# Altium project WireLessPhone.PrjPcb
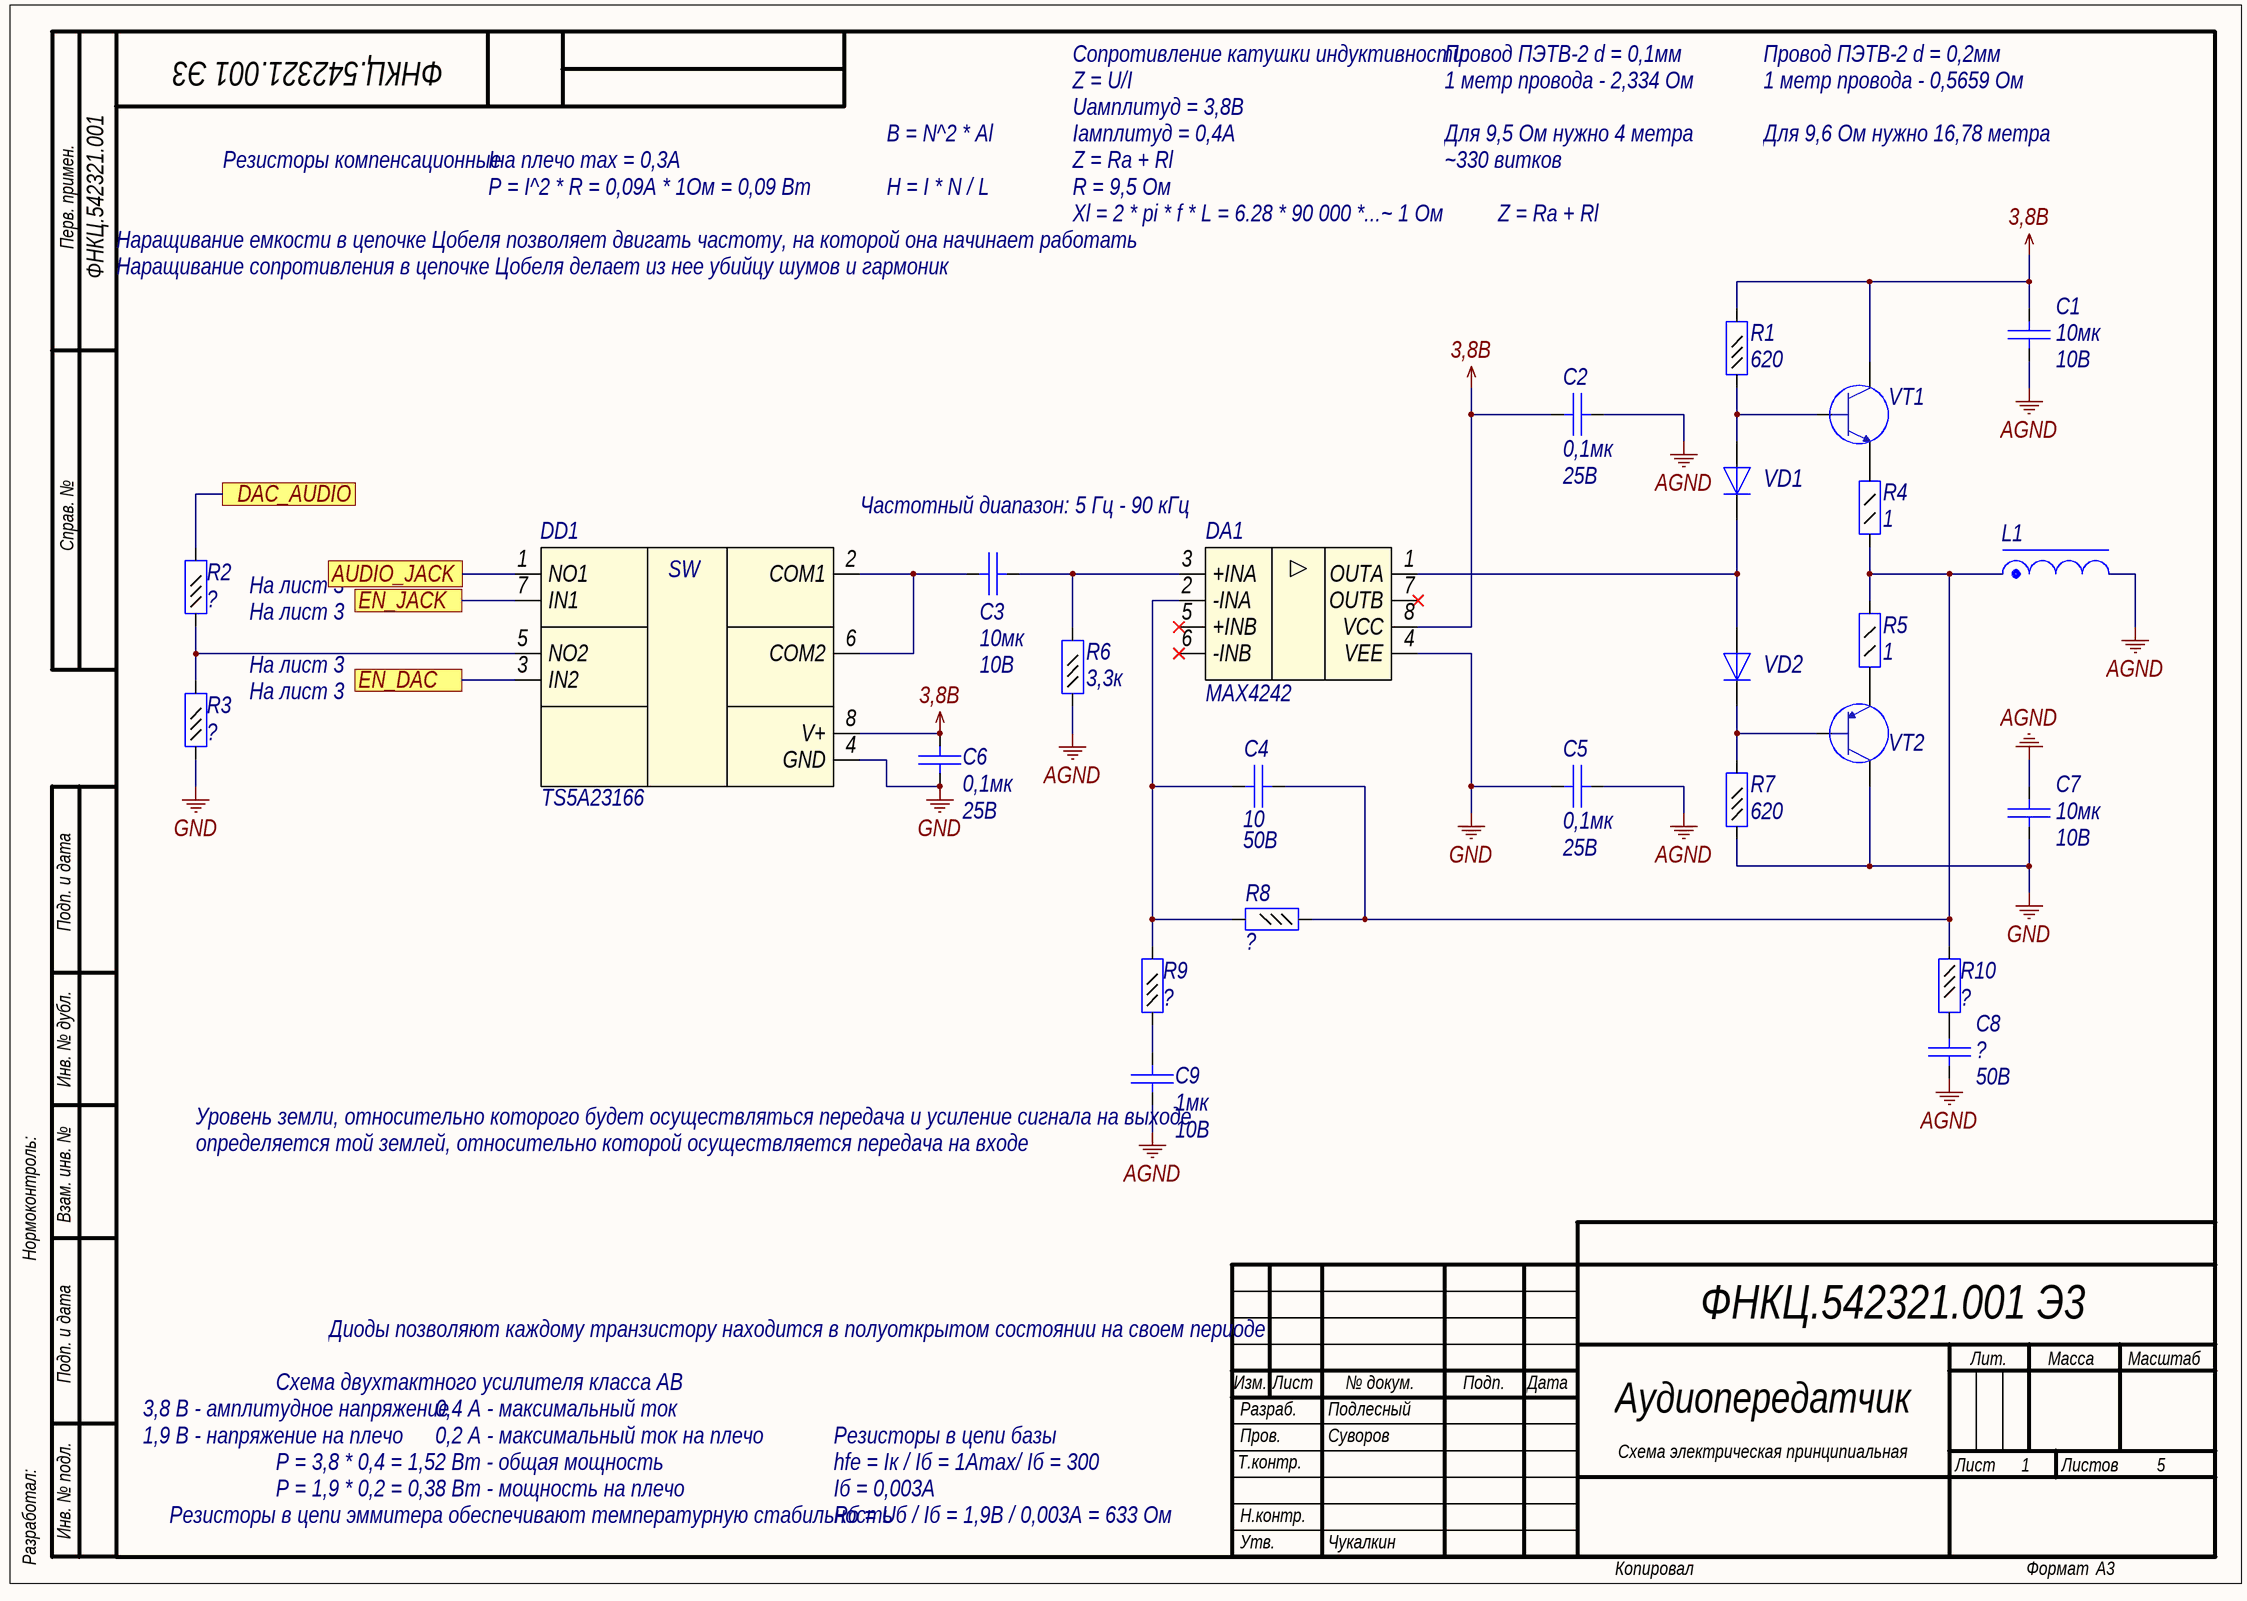
[diagram p0: WireLessPhone_Amp.SchDoc]
4 sheets, 91 parts. Net scope: flat (ports and power ports of the same name join across sheets).
Board file: WireLessPhone.PcbDoc
Sheets:
  WireLessPhone_Amp.SchDoc
  WireLessPhone_Power.SchDoc
  WireLessPhone_Microcontroller.SchDoc
  WireLessPhone_PhotoHall.SchDoc

## Sheet WireLessPhone_Amp.SchDoc: Аудиопередатчик
size 420 x 297 mm; ApprovedBy: Чукалкин; CheckedBy: Суворов; DrawnBy: Подлесный; DocumentNumber: ФНКЦ.542321.001 Э3; SheetNumber: 1; SheetTotal: 5; DocumentType: Схема электрическая принципиальная; Format: A3; ImagePath: ФНКЦ.542321.001

### Parts
C1  value 10мк  Voltage: 10В  [C0805]  (hidden comment: Capacitor)
C2  value 0,1мк  Voltage: 25B  [C0402]  (hidden comment: Capacitor)
C3  value 10мк  Voltage: 10В  [C0805]  (hidden comment: Capacitor)
C4  value 10  Voltage: 50B  [C0402]  (hidden comment: Capacitor)
C5  value 0,1мк  Voltage: 25B  [C0402]  (hidden comment: Capacitor)
C6  value 0,1мк  Voltage: 25B  [C0402]  (hidden comment: Capacitor)
C7  value 10мк  Voltage: 10В  [C0805]  (hidden comment: Capacitor)
C8  Voltage: 50B  [C0402]  (hidden comment: Capacitor)
C9  value 1мк  Voltage: 10B  [C0402]  (hidden comment: Capacitor)
DA1  MAX4242  [8µMAX]
DD1  TS5A23166  [US8]
L1  InductorSerd  [InductorPetlya]  (value not drawn)
R1  value 620  [R0402]  (hidden comment: Resistor_0,062Вт)
R2  Resistor_0,062Вт  [R0402]  (value not drawn)
R3  Resistor_0,062Вт  [R0402]  (value not drawn)
R4  value 1  [R0805]  (hidden comment: Resistor_0,125Вт)
R5  value 1  [R0805]  (hidden comment: Resistor_0,125Вт)
R6  value 3,3к  [R0402]  (hidden comment: Resistor_0,062Вт)
R7  value 620  [R0402]  (hidden comment: Resistor_0,062Вт)
R8  Resistor_0,062Вт  [R0402]  (value not drawn)
R9  Resistor_0,062Вт  [R0402]  (value not drawn)
R10  Resistor_0,062Вт  [R0402]  (value not drawn)
VD1  Diode  [SOD-323]  (value not drawn)
VD2  Diode  [SOD-323]  (value not drawn)
VT1  BJT NPN  [SOT-223]  (value not drawn)
VT2  BJT PNP  [SOT-223]  (value not drawn)

### Ports
AUDIO_JACK, DAC_AUDIO, EN_DAC, EN_JACK

### Nets
3,8B: C1.2 C2.2 C6.1 DA1.8(VCC) DD1.8(V+) R1.2 VT1.2
AGND: C1.1 C2.1 C5.1 C7.2 C8.1 C9.1 L1.2 R6.1
GND: C5.2 C6.2 C7.1 DA1.4(VEE) DD1.4(GND) R3.1 R7.1 VT2.2
NetC3_1: C3.1 DD1.2(COM1) DD1.6(COM2)
NetC3_2: C3.2 DA1.3(+INA) R6.2
NetC4_1: C4.1 DA1.2(-INA) R8.2 R9.2
NetC4_2: C4.2 L1.1 R4.1 R5.2 R8.1 R10.1
NetC8_2: C8.2 R10.2
NetC9_2: C9.2 R9.1
NetDA1_1: DA1.1(OUTA) VD1.1(K) VD2.2(A)
NetDD1_1: DD1.1(NO1) ; port AUDIO_JACK
NetDD1_3: DD1.3(IN2) ; port EN_DAC
NetDD1_5: DD1.5(NO2) R2.1 R3.2
NetDD1_7: DD1.7(IN1) ; port EN_JACK
NetDD3_8: R2.2 ; port DAC_AUDIO
NetR1_1: R1.1 VD1.2(A) VT1.1
NetR4_2: R4.2 VT1.3
NetR5_1: R5.1 VT2.3
NetR7_2: R7.2 VD2.1(K) VT2.1

Not connected (* = marked no-connect by the designer): DA1 5(+INB)* 6(-INB)* 7(OUTB)*

### Notes on the sheet
- Сопротивление катушки индуктивности:
- Z = U/I
- Uамплитуд = 3,8B
- Провод ПЭТВ-2 d = 0,1мм
- 1 метр провода - 2,334 Ом
- Провод ПЭТВ-2 d = 0,2мм
- 1 метр провода - 0,5659 Ом
- Перв. примен.
- Резисторы компенсационные
- Iна плечо max = 0,3A
- B = N^2 * Al
- Iамплитуд = 0,4A
- Z = Ra + Rl
- Для 9,5 Ом нужно 4 метра
- ~330 витков
- Для 9,6 Ом нужно 16,78 метра
- Наращивание емкости в цепочке Цобеля позволяет двигать частоту, на которой она начинает работать
- P = I^2 * R = 0,09A * 1Ом = 0,09 Вт
- H = I * N / L
- R = 9,5 Ом
- Xl = 2 * pi * f * L = 6.28 * 90 000 *...~ 1 Ом
- Наращивание сопротивления в цепочке Цобеля делает из нее убийцу шумов и гармоник
- Справ. №
- Частотный диапазон: 5 Гц - 90 кГц
- (near R2) На лист 3
- (near R3) На лист 3
- На лист 3
- Подп. и дата
- Инв. № дубл.
- (near C9) Уровень земли, относительно которого будет осуществляться передача и усиление сигнала на выходе
- Нормоконтроль:
- Взам. инв. №
- (near C9) определяется той землей, относительно которой осуществляется передача на входе
- Диоды позволяют каждому транзистору находится в полуоткрытом состоянии на своем периоде
- Схема двухтактного усилителя класса АВ
- Изм.
- Лист
- № докум.
- Подп.
- Дата
- Лит.
- Масса
- Масштаб
- 3,8 В - амплитудное напряжение
- 1,9 В - напряжение на плечо
- Р = 3,8 * 0,4 = 1,52 Вт - общая мощность
- 0,4 А - максимальный ток
- 0,2 А - максимальный ток на плечо
- Резисторы в цепи базы
- hfe = Iк / Iб = 1Amax/ Iб = 300
- Т.контр.
- Пров.
- Разраб.
- Листов
- Разработал:
- Инв. № подл.
- Резисторы в цепи эммитера обеспечивают температурную стабильность
- Р = 1,9 * 0,2 = 0,38 Вт - мощность на плечо
- Iб = 0,003A
- Rб = Uб / Iб = 1,9В / 0,003A = 633 Ом
- Н.контр.
- Утв.
- Копировал
- Формат
- (in symbol logic11) SW

### Library data of the parts
C1 C3 C7 = cap201: Конденсатор; Part Name: Ceramic; Manufacture: Murata; Part Number: GRM21BR71A106KE51L; id: cap201; TKE: X7R
C2 C5 C6 = cap52: Конденсатор; Part Name: Ceramic; Manufacture: Murata; Part Number: GRM155F51E104Z**; id: cap52; TKE: Y5V
C4 C8 = cap5: Конденсатор; Part Name: Ceramic; Manufacture: Murata; Part Number: GRM1535C1H100J; id: cap5; TKE: NP0
  C8: Value: ?
C9 = cap55: Конденсатор; Part Name: Ceramic; Manufacture: Murata; Part Number: GRM155R61A105K; id: cap55; TKE: Y5V
DA1 = amp13: МИКРОМОЩНЫЙ Single/Dual/Quad, +1.8V/10µA, SOT23,  Beyond-the-Rails Op Amps; Part Name: Micropower / Operational Amplifiers; Part Number: MAX4242EUA; Manufacture: Maxim Integrated; id: amp13; Rail-to-rail: yes; Supply Voltage: 1,8В–5,5В or (+-)0,9В-(+-)2,75B; Supply Current max: 10uA; Bandwidth: 90kHz; Input Bias Current: (+-)2,3nA; CMRR: 90dB; PSRR: 85dB; Offset voltage: (+-)0,2mB; Channels: 1
DD1 = logic11: Dual-SPST Analog Switch; Manufacture: Texas Instruments; Type of Logic: CMOS; Number of elements: 2; Logic High Level: 1,5-5,5B; Logic Low Level: 0,6B; Charge Injection: 6pC; Toff: 5ns; Ton: 8,5ns; Resistance of channel: 1,1Ohm; Power Supply: 1,65В-5,5B; id: logic11; Part Name: Dual-SPST Analog Switch; Part Number: TS5A23166
L1 = ind67: EMI Suppression Filter; Part Name: My own inductor for petlya; id: ind67
R1 R7 = res261: Резистор; Manufacture: Yageo; Part Number: RC0402FR-07620RL; id: res261; Accuracy: 1%; Part Name: Resistor; Power: 0,062Вт
R2 R3 R6 R8-R10 = res278: Резистор; Manufacture: Yageo; Part Number: RC0402FR-072K3; id: res278; Accuracy: 1%; Part Name: Resistor; Power: 0,062Вт
  R2 R3 R8-R10: Value: ?
R4 R5 = res1: Резистор; Manufacture: Yageo; Part Number: RC0805FR-071RL; id: res1; Accuracy: 1%; Part Name: Resistor; Power: 0,125Вт
VD1 VD2 = diode18: Диод; Part Number: BAS321.115; Manufacture: NXP Semiconductor; Max Reverse Voltage: 250В; Forward Voltage: 1,25В; Forward Current: 0,25А; Breakdown Current: 100nA; Reverse Recovery time: 50ns; Capacitance: 2pF; Number of Channels: 1; id: diode18; Part Name: Diode
VT1 = bjt3: Part Name: Transistor; Part Number: PBSS4540Z.115; Manufacture: NXP Semiconductor; id: bjt3; hfe: 300; Vceo max: 40В; Ic max: 5А; Power: 2Вт; Frequency: 130МГц; Structure: npn
VT2 = bjt4: Part Name: Transistor; Part Number: PBSS5540Z.115; Manufacture: NXP Semiconductor; id: bjt4; hfe: 300; Vceo max: 40В; Ic max: 5А; Power: 2Вт; Frequency: 130МГц; Structure: pnp

## Sheet WireLessPhone_Power.SchDoc
size 420 x 297 mm; DocumentNumber: ФНКЦ.542321.001 Э3; SheetNumber: 2; Format: A3
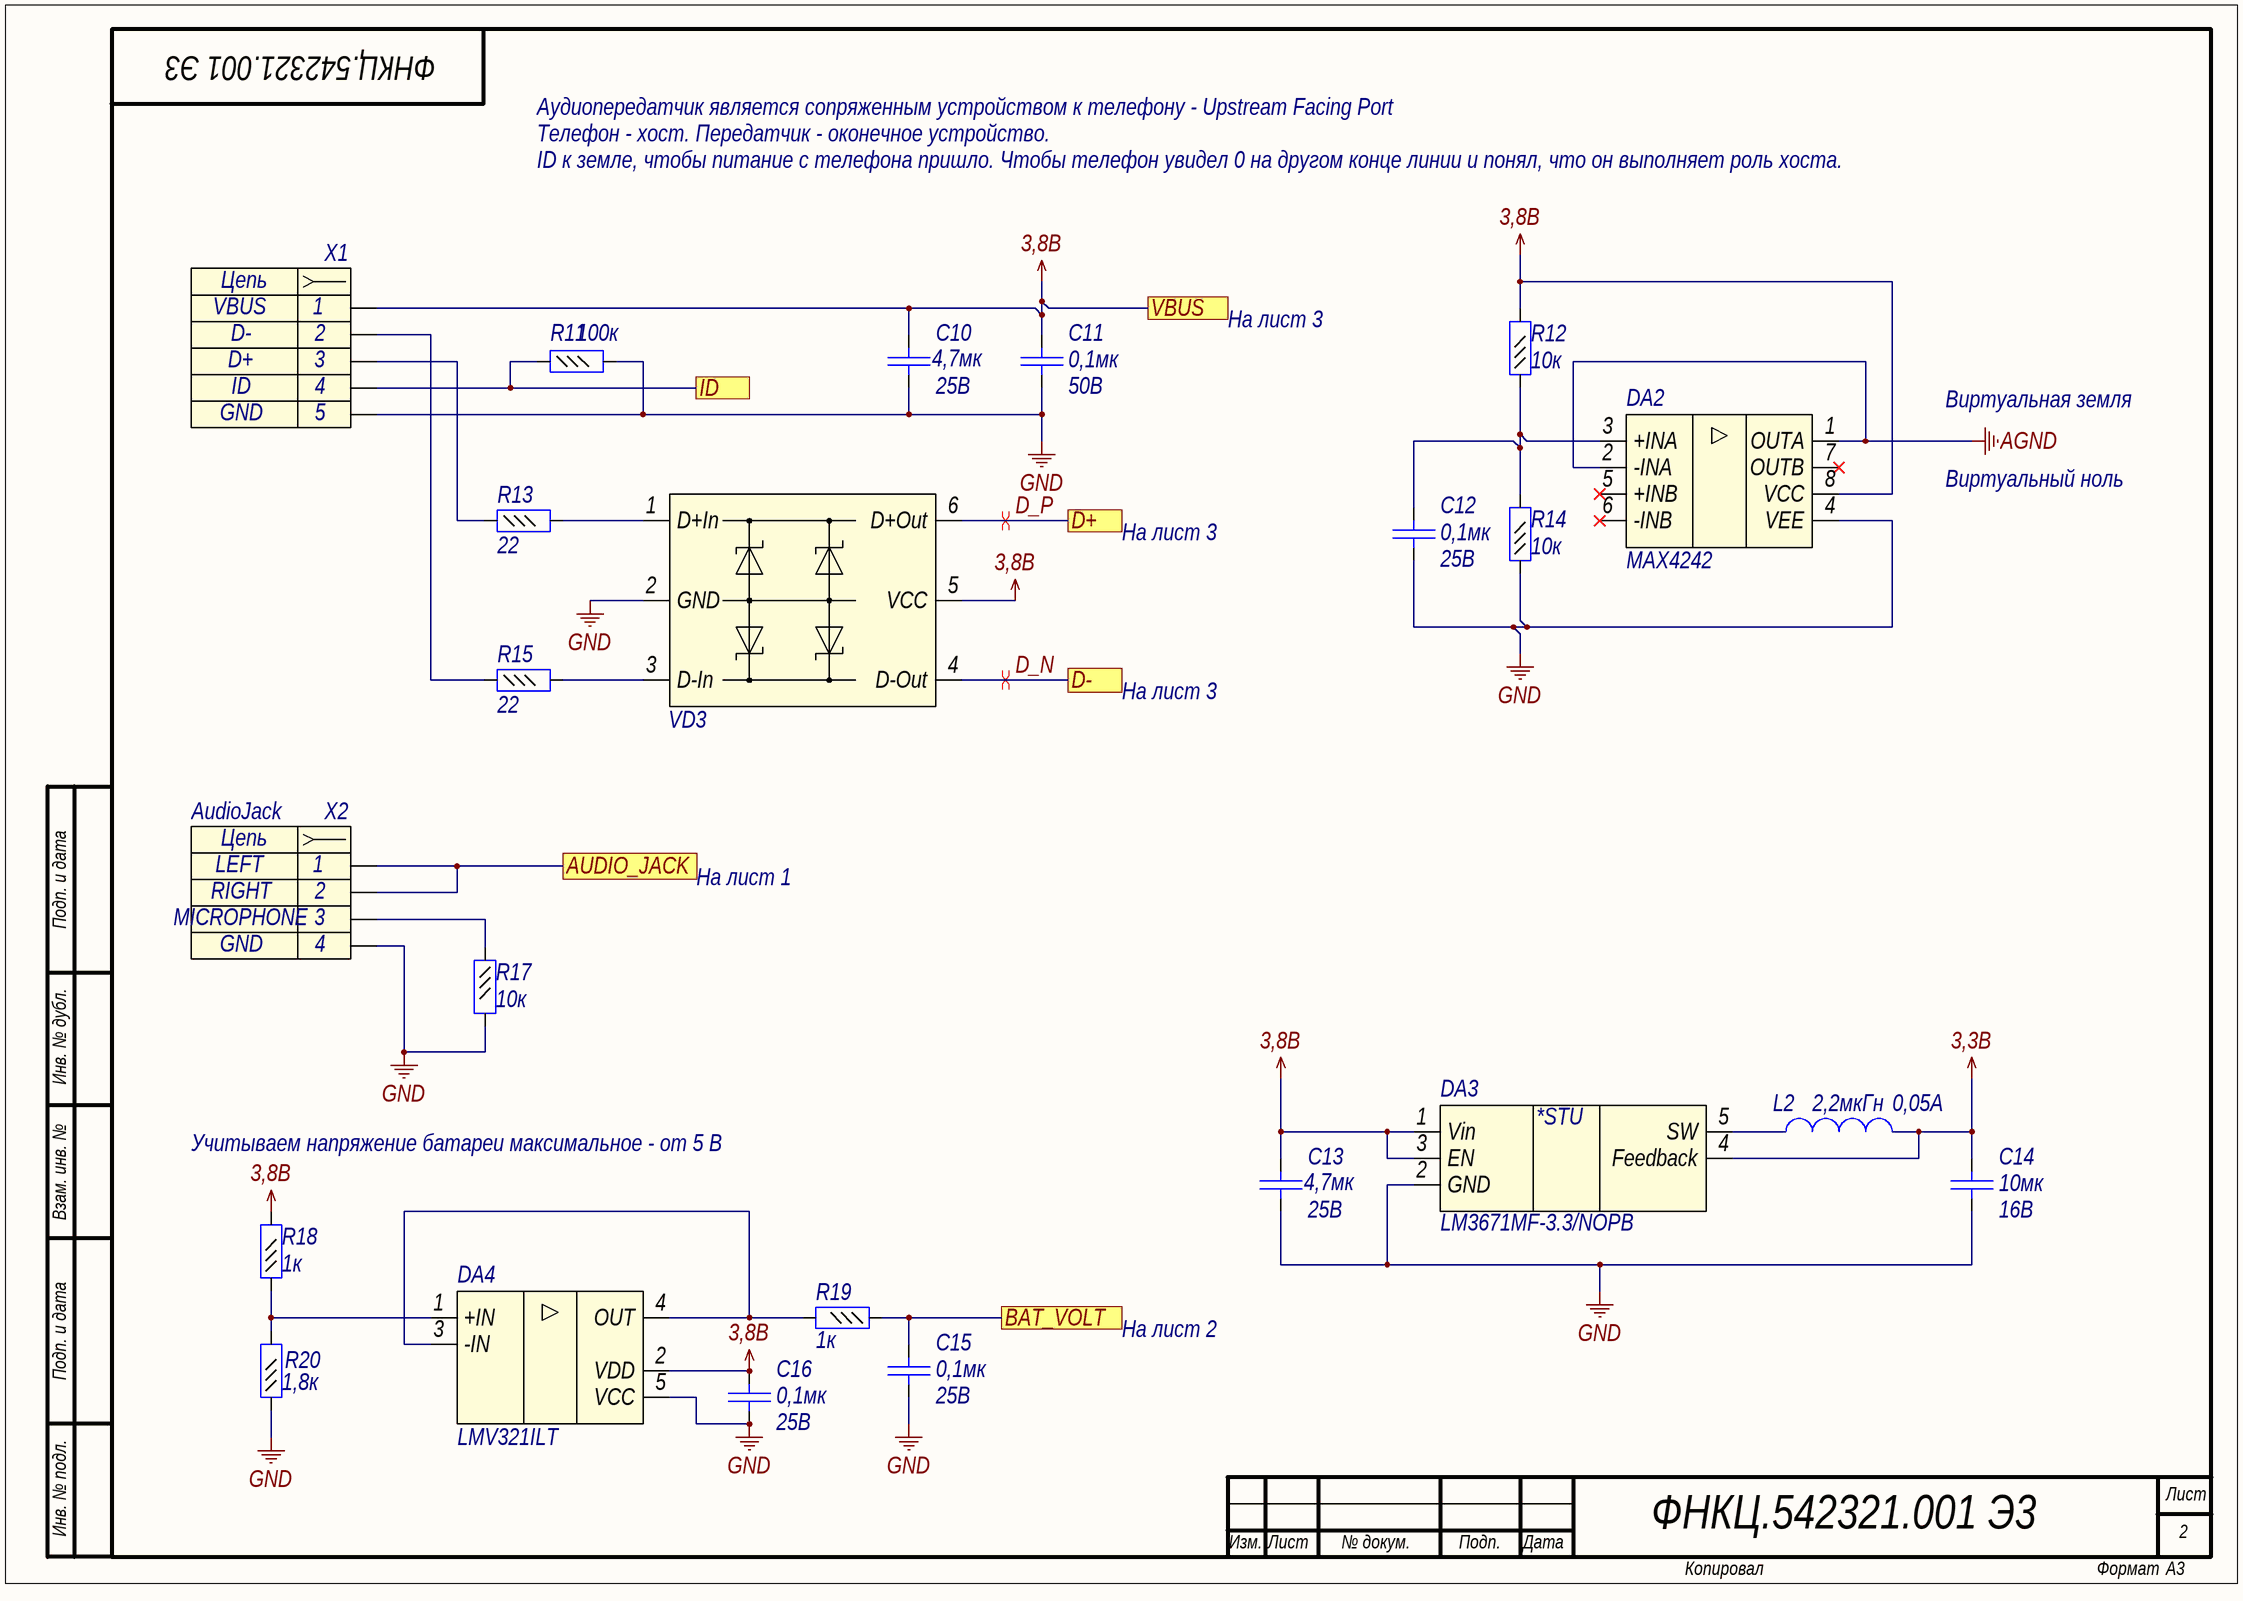
[diagram p1: WireLessPhone_Power.SchDoc]

### Parts
C10  value 4,7мк  Voltage: 25B  [C0805]  (hidden comment: Capacitor)
C11  value 0,1мк  Voltage: 50B  [C0603]  (hidden comment: Capacitor)
C12  value 0,1мк  Voltage: 25B  [C0402]  (hidden comment: Capacitor)
C13  value 4,7мк  Voltage: 25B  [C0805]  (hidden comment: Capacitor)
C14  value 10мк  Voltage: 16В  [C1206]  (hidden comment: Capacitor)
C15  value 0,1мк  Voltage: 25B  [C0402]  (hidden comment: Capacitor)
C16  value 0,1мк  Voltage: 25B  [C0402]  (hidden comment: Capacitor)
DA2  MAX4242  [8µMAX]
DA3  LM3671MF-3.3/NOPB  [SOT23-5]
DA4  LMV321ILT  [SOT23-5]
L2  value 2,2мкГн  Rated Current: 0,05A  [L0805]  (hidden comment: Inductor)
R11  value 100к  [R0402]  (hidden comment: Resistor_0,062Вт)
R12  value 10к  [R0402]  (hidden comment: Resistor_0,062Вт)
R13  value 22  [R0402]  (hidden comment: Resistor_0,062Вт)
R14  value 10к  [R0402]  (hidden comment: Resistor_0,062Вт)
R15  value 22  [R0402]  (hidden comment: Resistor_0,062Вт)
R17  value 10к  [R0402]  (hidden comment: Resistor_0,062Вт)
R18  value 1к  [R0402]  (hidden comment: Resistor_0,062Вт)
R19  value 1к  [R0402]  (hidden comment: Resistor_0,062Вт)
R20  value 1,8к  [R0402]  (hidden comment: Resistor_0,062Вт)
VD3  USBUF  [SOT323-6L]  (value not drawn)
X1  Header_5_sct  [5HOLE_SMALL]  (value not drawn)
X2  AudioJack  [4HOLE_SMALL]

### Ports
AUDIO_JACK, BAT_VOLT, D+, D-, ID, VBUS

### Nets
3,3B: C14.2 DA3.4(Feedback) L2.2
3,8B: C10.2 C11.2 C13.2 C16.1 DA2.8(VCC) DA3.1(Vin) DA3.3(EN) DA4.2(VDD) R12.2 R18.2 VD3.5(VCC) X1.1 ; port VBUS
AGND: DA2.1(OUTA) DA2.2(-INA)
GND: C10.1 C11.1 C12.2 C13.1 C14.1 C15.2 C16.2 DA2.4(VEE) DA3.2(GND) DA4.5(VCC) R11.2 R14.1 R17.2 R20.1 VD3.2(GND) X1.5 X2.4
D_N: VD3.4(D-Out) ; port D-
D_P: VD3.6(D+Out) ; port D+
NetC12_1: C12.1 DA2.3(+INA) R12.1 R14.2
NetC15_1: C15.1 R19.1 ; port BAT_VOLT
NetDA3_5: DA3.5(SW) L2.1
NetDA4_1: DA4.1(+IN) R18.1 R20.2
NetDA4_3: DA4.3(-IN) DA4.4(OUT) R19.2
NetDD1_1: X2.1 X2.2 ; port AUDIO_JACK
NetDD2_43: R11.1 X1.4 ; port ID
NetR13_1: R13.1 X1.3
NetR13_2: R13.2 VD3.1(D+In)
NetR15_1: R15.1 X1.2
NetR15_2: R15.2 VD3.3(D-In)
NetR17_1: R17.1 X2.3

Not connected (* = marked no-connect by the designer): DA2 5(+INB)* 6(-INB)* 7(OUTB)*

### Layout directives
differential pair: D_N, D_P

### Notes on the sheet
- Аудиопередатчик является сопряженным устройством к телефону - Upstream Facing Port
- Телефон - хост. Передатчик - оконечное устройство.
- ID к земле, чтобы питание с телефона пришло. Чтобы телефон увидел 0 на другом конце линии и понял, что он выполняет роль хоста.
- На лист 3
- Виртуальная земля
- Виртуальный ноль
- Подп. и дата
- На лист 1
- Инв. № дубл.
- Взам. инв. №
- Учитываем напряжение батареи максимальное - от 5 В
- На лист 2
- Инв. № подл.
- Лист
- Изм.
- № докум.
- Подп.
- Дата
- Копировал
- Формат
- (in symbol connect44) Цепь
- (in symbol connect45) Цепь
- (in symbol pwr2) *STU

### Library data of the parts
C10 C13 = cap154: Конденсатор; Part Name: Ceramic; Manufacture: Murata; Part Number: GRM21BR61E475KA12L; id: cap154; TKE: X5R
C11 = cap131: Конденсатор; Part Name: Ceramic; Manufacture: Murata; Part Number: GRM188R71H104K; id: cap131; TKE: X7R
C12 C15 C16 = cap52: as C2 on sheet WireLessPhone_Amp
C14 = cap191: Конденсатор; Part Name: Ceramic; Manufacture: Murata; Part Number: GRM31CR71C106K*; id: cap191; TKE: X7R
DA2 = amp13: as DA1 on sheet WireLessPhone_Amp
DA3 = pwr2: Step-Down DC-DC Converter; Part Name: 600-mA Step-Down DC-DC Converter; Manufacturer: Texas Instruments; id: pwr2; Input Voltage: 2,7 - 5,5B; Output Voltage: 3,3B; Current: 0,6A; Type: Impulse; Part Number: LM3671MF-3.3/NOPB
DA4 = amp10: HIGH-DRIVE OPERATIONAL AMPLIFIERS WITH SHUTDOWN; Part Name: Micropower / Operational Amplifiers; Manufacture: ST Microelectronics; id: amp10; Rail-to-rail: yes; Supply Voltage: 2,7-6B; Supply Current max: 200uA; Bandwidth: 1MHz; Input Bias Current: 10nA; CMRR: 85dB; PSRR: 80dB; Offset voltage: 0,1mB; Channels: 1; Part Number: LMV321ILT
L2 = ind4: EMI Suppression Filter; Part Number: MLF2012A2R2KT000; Manufacture: Mouser; id: ind4; Resistance: 500mOhm; Part Name: Inductor
R11 = res314: Резистор; Manufacture: Yageo; Part Number: RC0402FR-07100KL; id: res314; Accuracy: 1%; Part Name: Resistor; Power: 0,062Вт
R12 R14 R17 = res290: Резистор; Manufacture: Yageo; Part Number: RC0402FR-0710KL; id: res290; Accuracy: 1%; Part Name: Resistor; Power: 0,062Вт
R13 R15 = res226: Резистор; Manufacture: Yageo; Part Number: RC0402FR-0722RL; id: res226; Accuracy: 1%; Part Name: Resistor; Power: 0,062Вт
R18 R19 = res266: Резистор; Manufacture: Yageo; Part Number: RC0402FR-071KL; id: res266; Accuracy: 1%; Part Name: Resistor; Power: 0,062Вт
R20 = res272: Резистор; Manufacture: Yageo; Part Number: RC0402FR-071K8; id: res272; Accuracy: 1%; Part Name: Resistor; Power: 0,062Вт
VD3 = diode14: EMEMI filter and line termination for USB upstream ports; Part Name: EMI filter for USB upstream ports; Part Number: USBUF02W6; Manufacture: ST Microelectronics; Capacitance: 47pF; Number of Channels: 2; id: diode14
X1 = connect44: Разъем - 5 конт. розетка; Part Name: SMALL HALL 5; Contact_1: VBUS; Contact_2: D-; Contact_3: D+; Contact_4: ID; Contact_5: GND; Etch: 1,5mm; id: connect44
X2 = connect45: Разъем - 4 конт. розетка; Part Name: SMALL HALL 4; Contact_1: LEFT; Contact_2: RIGHT; Contact_3: MICROPHONE; Contact_4: GND; Etch: 1,5mm; id: connect45

## Sheet WireLessPhone_Microcontroller.SchDoc
size 840 x 594 mm; DocumentNumber: ФНКЦ.542321.001 Э3; SheetNumber: 3; Format: A1
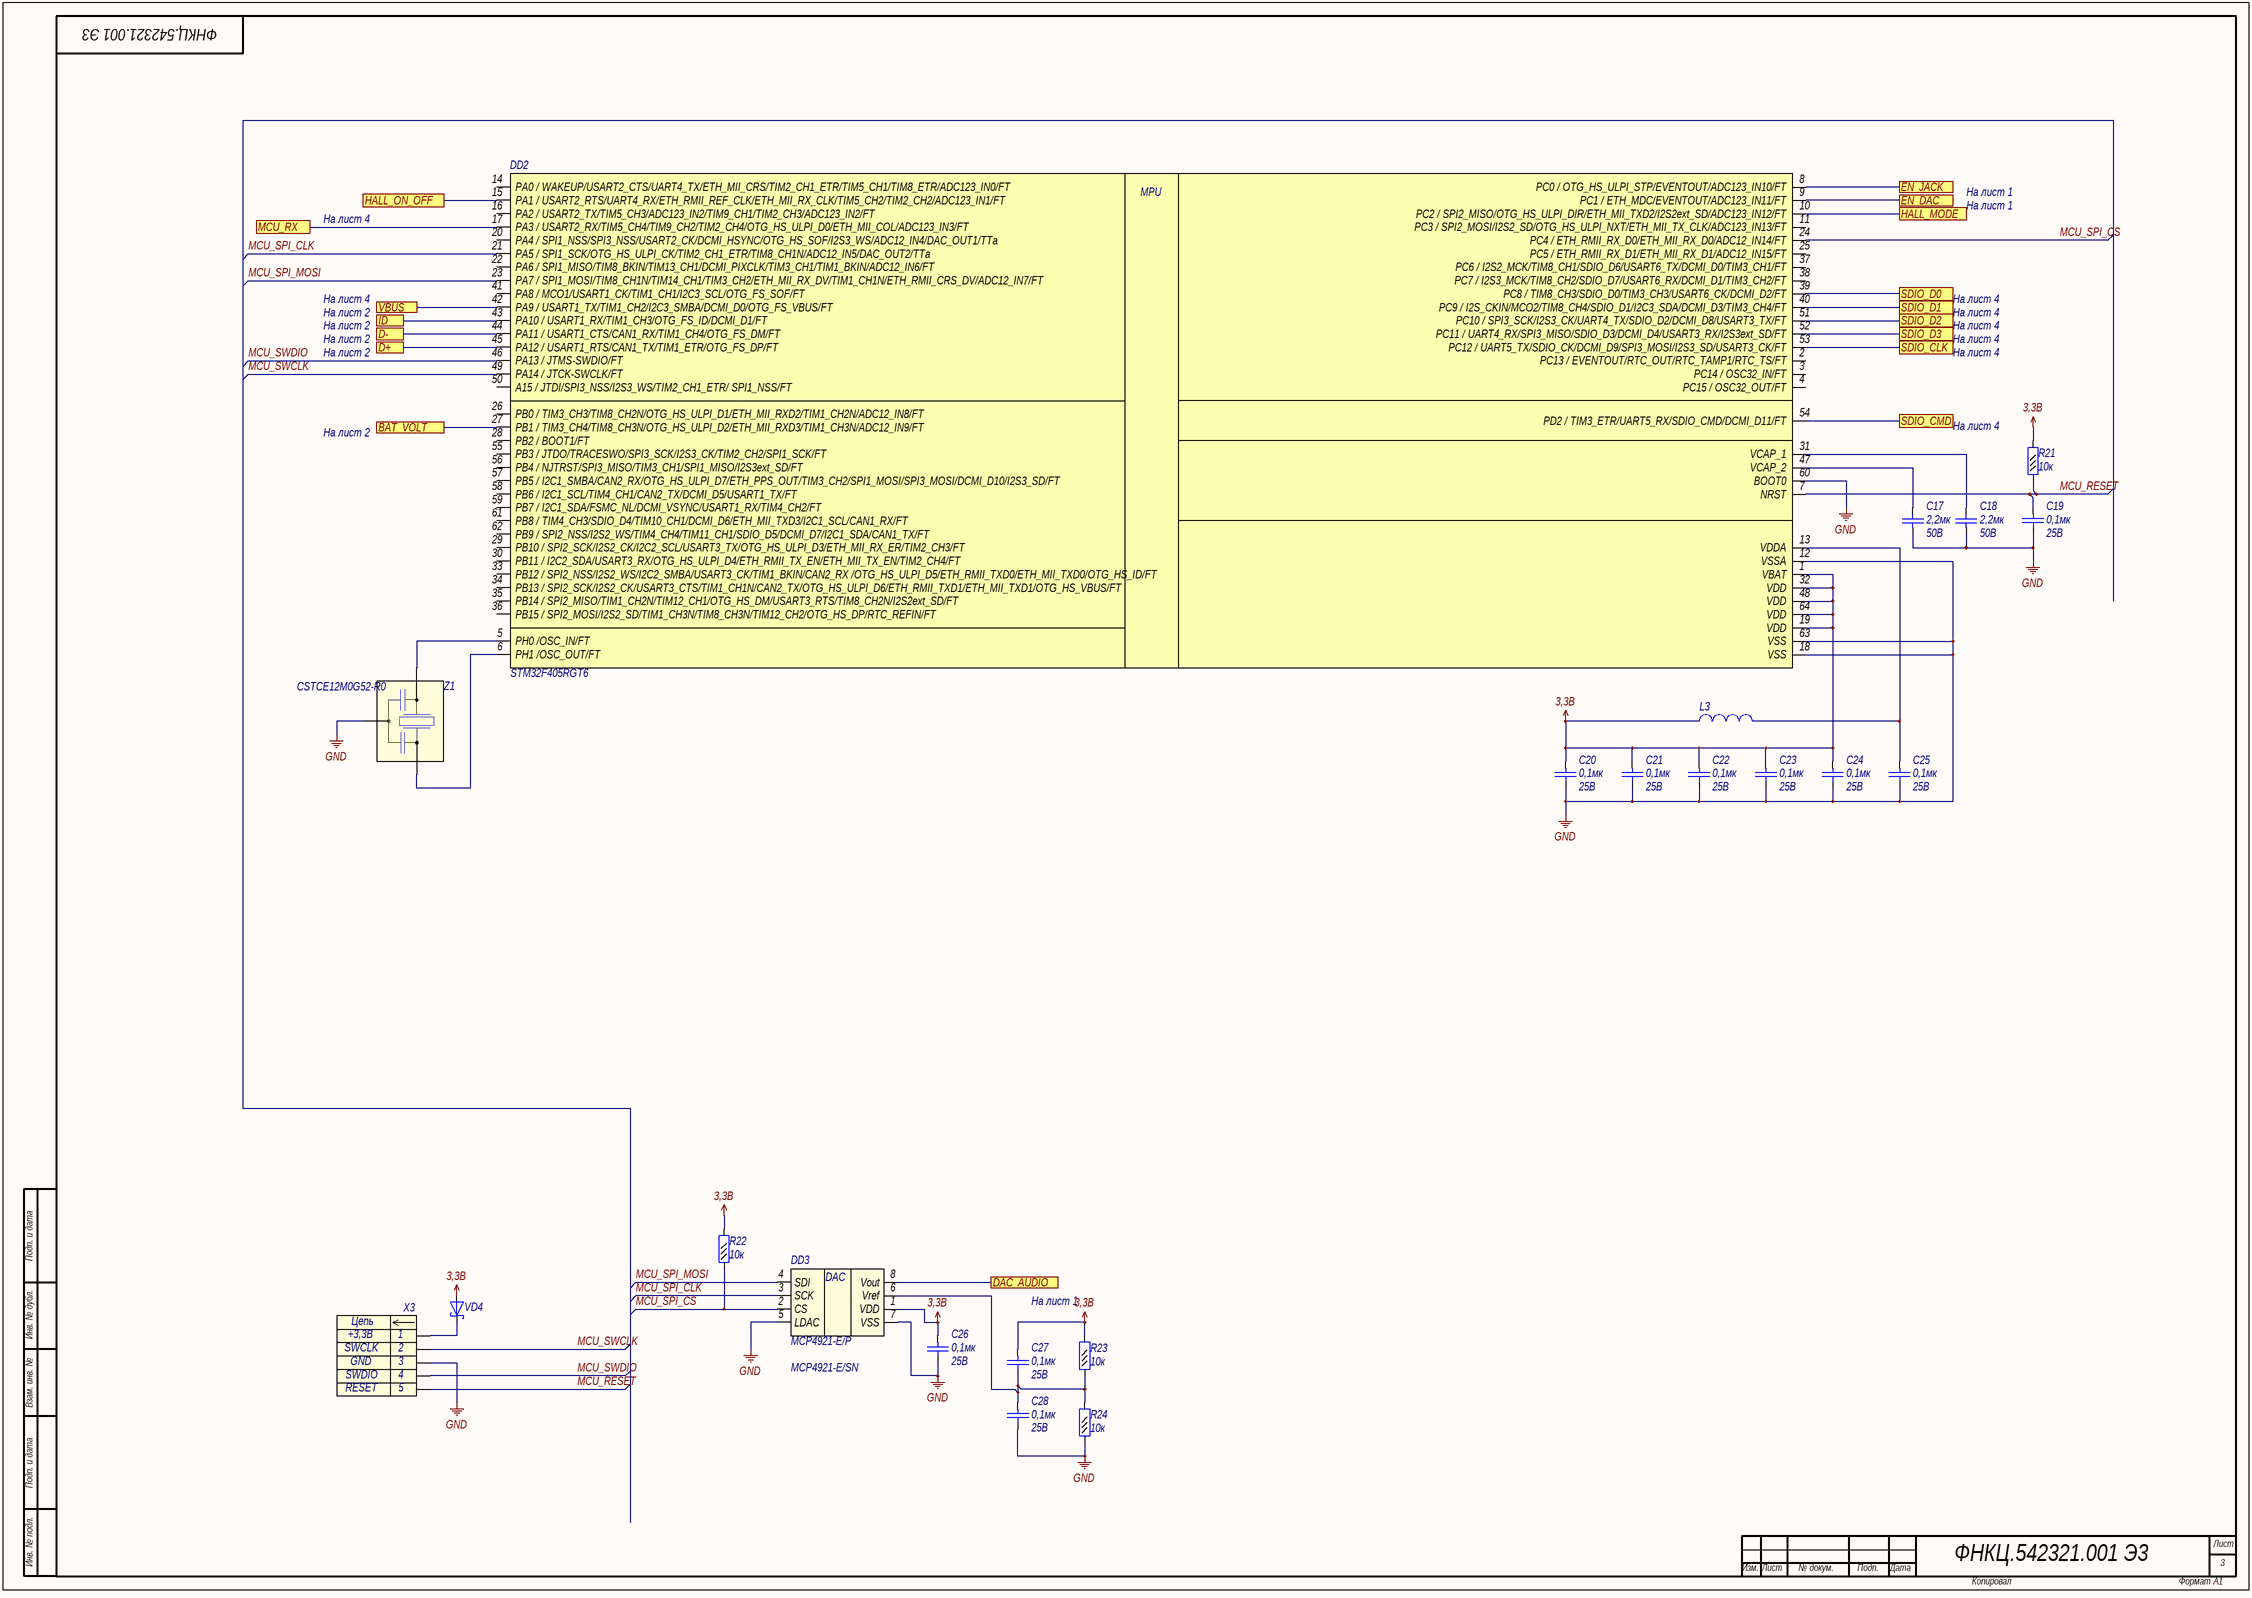
[diagram p2: WireLessPhone_Microcontroller.SchDoc]

### Parts
(Parts that share a designator on the sheet are numbered #1, #2 ... from top to bottom, then left to right.)
C17  value 2,2мк  Voltage: 50B  [C0603]  (hidden comment: Capacitor)
C18  value 2,2мк  Voltage: 50B  [C0603]  (hidden comment: Capacitor)
C19  value 0,1мк  Voltage: 25B  [C0402]  (hidden comment: Capacitor)
C20  value 0,1мк  Voltage: 25B  [C0402]  (hidden comment: Capacitor)
C21  value 0,1мк  Voltage: 25B  [C0402]  (hidden comment: Capacitor)
C22  value 0,1мк  Voltage: 25B  [C0402]  (hidden comment: Capacitor)
C23  value 0,1мк  Voltage: 25B  [C0402]  (hidden comment: Capacitor)
C24  value 0,1мк  Voltage: 25B  [C0402]  (hidden comment: Capacitor)
C25  value 0,1мк  Voltage: 25B  [C0402]  (hidden comment: Capacitor)
C26  value 0,1мк  Voltage: 25B  [C0402]  (hidden comment: Capacitor)
C27  value 0,1мк  Voltage: 25B  [C0402]  (hidden comment: Capacitor)
C28  value 0,1мк  Voltage: 25B  [C0402]  (hidden comment: Capacitor)
DD2  STM32F405RGT6  [LQFP64]
DD3  MCP4921-E/P  [SO8]
L3  Inductor  [L0603]  (value not drawn)
R21  value 10к  [R0402]  (hidden comment: Resistor_0,062Вт)
R22#1  value 10к  [R0402]  (hidden comment: Resistor_0,062Вт)
R23#1  value 10к  [R0402]  (hidden comment: Resistor_0,062Вт)
R24#1  value 10к  [R0402]  (hidden comment: Resistor_0,062Вт)
VD4  DiodeSchottky  [SOD-523]  (value not drawn)
X3  Header_5_plg  [PLS-5]  (value not drawn)
Z1  Part Number: CSTCE12M0G52-R0  [CSTCE]  (hidden comment: QuartzWithCaps)

### Ports
BAT_VOLT, D+, D-, DAC_AUDIO, EN_DAC, EN_JACK, HALL_MODE, HALL_ON_OFF, ID, MCU_RX, SDIO_CLK, SDIO_CMD, SDIO_D0, SDIO_D1, SDIO_D2, SDIO_D3, VBUS

### Nets
3,3B: C20.1 C21.1 C22.1 C23.1 C24.1 C26.1 C27.1 DD2.1(VBAT) DD2.19(VDD) DD2.32(VDD) DD2.48(VDD) DD2.64(VDD) DD3.1(VDD) L3.1 R21.2 R22#1.2 R23#1.2 VD4.2(A)
3,8B: DD2.42(PA9_/_USART1_TX/TIM1_CH2/I2C3_SMBA/DCMI_D0/OTG_FS_VBUS/FT) ; port VBUS
GND: C17.1 C18.1 C19.2 C20.2 C21.2 C22.2 C23.2 C24.2 C25.2 C26.2 C28.2 DD2.12(VSSA) DD2.18(VSS) DD2.60(BOOT0) DD2.63(VSS) DD3.5(LDAC) DD3.7(VSS) R24#1.1 X3.3 Z1.2
D_N: DD2.44(PA11_/_USART1_CTS/CAN1_RX/TIM1_CH4/OTG_FS_DM/FT) ; port D-
D_P: DD2.45(PA12_/_USART1_RTS/CAN1_TX/TIM1_ETR/OTG_FS_DP/FT) ; port D+
MCU_RESET: C19.1 DD2.7(NRST) R21.1 X3.5
MCU_SPI_CLK: DD2.21(PA5_/_SPI1_SCK/OTG_HS_ULPI_CK/TIM2_CH1_ETR/TIM8_CH1N/ADC12_IN5/DAC_OUT2/TTa) DD3.3(SCK)
MCU_SPI_CS: DD2.24(PC4_/_ETH_RMII_RX_D0/ETH_MII_RX_D0/ADC12_IN14/FT) DD3.2(CS) R22#1.1
MCU_SPI_MOSI: DD2.23(PA7_/_SPI1_MOSI/TIM8_CH1N/TIM14_CH1/TIM3_CH2/ETH_MII_RX_DV/TIM1_CH1N/ETH_RMII_CRS_DV/ADC12_IN7/FT) DD3.4(SDI)
MCU_SWCLK: DD2.49(PA14_/_JTCK-SWCLK/FT) X3.2
MCU_SWDIO: DD2.46(PA13_/_JTMS-SWDIO/FT) X3.4
NetC15_1: DD2.27(PB1_/_TIM3_CH4/TIM8_CH3N/OTG_HS_ULPI_D2/ETH_MII_RXD3/TIM1_CH3N/ADC12_IN9/FT) ; port BAT_VOLT
NetC17_2: C17.2 DD2.47(VCAP_2)
NetC18_2: C18.2 DD2.31(VCAP_1)
NetC25_1: C25.1 DD2.13(VDDA) L3.2
NetC27_2: C27.2 C28.1 DD3.6(Vref) R23#1.1 R24#1.2
NetC32_1: DD2.15(PA1_/_USART2_RTS/UART4_RX/ETH_RMII_REF_CLK/ETH_MII_RX_CLK/TIM5_CH2/TIM2_CH2/ADC123_IN1/FT) ; port HALL_ON_OFF
NetC35_1: DD2.10(PC2_/_SPI2_MISO/OTG_HS_ULPI_DIR/ETH_MII_TXD2/I2S2ext_SD/ADC123_IN12/FT) ; port HALL_MODE
NetDD1_3: DD2.9(PC1_/_ETH_MDC/EVENTOUT/ADC123_IN11/FT) ; port EN_DAC
NetDD1_7: DD2.8(PC0_/_OTG_HS_ULPI_STP/EVENTOUT/ADC123_IN10/FT) ; port EN_JACK
NetDD2_5: DD2.5(PH0_/OSC_IN/FT) Z1.1
NetDD2_6: DD2.6(PH1_/OSC_OUT/FT) Z1.3
NetDD2_17: DD2.17(PA3_/_USART2_RX/TIM5_CH4/TIM9_CH2/TIM2_CH4/OTG_HS_ULPI_D0/ETH_MII_COL/ADC123_IN3/FT) ; port MCU_RX
NetDD2_39: DD2.39(PC8_/_TIM8_CH3/SDIO_D0/TIM3_CH3/USART6_CK/DCMI_D2/FT) ; port SDIO_D0
NetDD2_40: DD2.40(PC9_/_I2S_CKIN/MCO2/TIM8_CH4/SDIO_D1/I2C3_SDA/DCMI_D3/TIM3_CH4/FT) ; port SDIO_D1
NetDD2_43: DD2.43(PA10_/_USART1_RX/TIM1_CH3/OTG_FS_ID/DCMI_D1/FT) ; port ID
NetDD2_51: DD2.51(PC10_/_SPI3_SCK/I2S3_CK/UART4_TX/SDIO_D2/DCMI_D8/USART3_TX/FT) ; port SDIO_D2
NetDD2_52: DD2.52(PC11_/_UART4_RX/SPI3_MISO/SDIO_D3/DCMI_D4/USART3_RX/I2S3ext_SD/FT) ; port SDIO_D3
NetDD2_53: DD2.53(PC12_/_UART5_TX/SDIO_CK/DCMI_D9/SPI3_MOSI/I2S3_SD/USART3_CK/FT) ; port SDIO_CLK
NetDD2_54: DD2.54(PD2_/_TIM3_ETR/UART5_RX/SDIO_CMD/DCMI_D11/FT) ; port SDIO_CMD
NetDD3_8: DD3.8(Vout) ; port DAC_AUDIO
NetVD4_1: VD4.1(K) X3.1

Not connected (* = marked no-connect by the designer): DD2 2(PC13_/_EVENTOUT/RTC_OUT/RTC_TAMP1/RTC_TS/FT) 3(PC14_/_OSC32_IN/FT) 4(PC15_/_OSC32_OUT/FT) 11(PC3_/_SPI2_MOSI/I2S2_SD/OTG_HS_ULPI_NXT/ETH_MII_TX_CLK/ADC123_IN13/FT) 14(PA0_/_WAKEUP/USART2_CTS/UART4_TX/ETH_MII_CRS/TIM2_CH1_ETR/TIM5_CH1/TIM8_ETR/ADC123_IN0/FT) 16(PA2_/_USART2_TX/TIM5_CH3/ADC123_IN2/TIM9_CH1/TIM2_CH3/ADC123_IN2/FT) 20(PA4_/_SPI1_NSS/SPI3_NSS/USART2_CK/DCMI_HSYNC/OTG_HS_SOF/I2S3_WS/ADC12_IN4/DAC_OUT1/TTa) 22(PA6_/_SPI1_MISO/TIM8_BKIN/TIM13_CH1/DCMI_PIXCLK/TIM3_CH1/TIM1_BKIN/ADC12_IN6/FT) 25(PC5_/_ETH_RMII_RX_D1/ETH_MII_RX_D1/ADC12_IN15/FT) 26(PB0_/_TIM3_CH3/TIM8_CH2N/OTG_HS_ULPI_D1/ETH_MII_RXD2/TIM1_CH2N/ADC12_IN8/FT) 28(PB2_/_BOOT1/FT) 29(PB10_/_SPI2_SCK/I2S2_CK/I2C2_SCL/USART3_TX/OTG_HS_ULPI_D3/ETH_MII_RX_ER/TIM2_CH3/FT) 30(PB11_/_I2C2_SDA/USART3_RX/OTG_HS_ULPI_D4/ETH_RMII_TX_EN/ETH_MII_TX_EN/TIM2_CH4/FT) 33(PB12_/_SPI2_NSS/I2S2_WS/I2C2_SMBA/USART3_CK/TIM1_BKIN/CAN2_RX_/OTG_HS_ULPI_D5/ETH_RMII_TXD0/ETH_MII_TXD0/OTG_HS_ID/FT) 34(PB13_/_SPI2_SCK/I2S2_CK/USART3_CTS/TIM1_CH1N/CAN2_TX/OTG_HS_ULPI_D6/ETH_RMII_TXD1/ETH_MII_TXD1/OTG_HS_VBUS/FT) 35(PB14_/_SPI2_MISO/TIM1_CH2N/TIM12_CH1/OTG_HS_DM/USART3_RTS/TIM8_CH2N/I2S2ext_SD/FT) 36(PB15_/_SPI2_MOSI/I2S2_SD/TIM1_CH3N/TIM8_CH3N/TIM12_CH2/OTG_HS_DP/RTC_REFIN/FT) 37(PC6_/_I2S2_MCK/TIM8_CH1/SDIO_D6/USART6_TX/DCMI_D0/TIM3_CH1/FT) 38(PC7_/_I2S3_MCK/TIM8_CH2/SDIO_D7/USART6_RX/DCMI_D1/TIM3_CH2/FT) 41(PA8_/_MCO1/USART1_CK/TIM1_CH1/I2C3_SCL/OTG_FS_SOF/FT) 50(A15_/_JTDI/SPI3_NSS/I2S3_WS/TIM2_CH1_ETR/_SPI1_NSS/FT) 55(PB3_/_JTDO/TRACESWO/SPI3_SCK/I2S3_CK/TIM2_CH2/SPI1_SCK/FT) 56(PB4_/_NJTRST/SPI3_MISO/TIM3_CH1/SPI1_MISO/I2S3ext_SD/FT) 57(PB5_/_I2C1_SMBA/CAN2_RX/OTG_HS_ULPI_D7/ETH_PPS_OUT/TIM3_CH2/SPI1_MOSI/SPI3_MOSI/DCMI_D10/I2S3_SD/FT) 58(PB6_/_I2C1_SCL/TIM4_CH1/CAN2_TX/DCMI_D5/USART1_TX/FT) 59(PB7_/_I2C1_SDA/FSMC_NL/DCMI_VSYNC/USART1_RX/TIM4_CH2/FT) 61(PB8_/_TIM4_CH3/SDIO_D4/TIM10_CH1/DCMI_D6/ETH_MII_TXD3/I2C1_SCL/CAN1_RX/FT) 62(PB9_/_SPI2_NSS/I2S2_WS/TIM4_CH4/TIM11_CH1/SDIO_D5/DCMI_D7/I2C1_SDA/CAN1_TX/FT)

### Notes on the sheet
- На лист 1
- На лист 4
- На лист 2
- Подп. и дата
- Инв. № дубл.
- Взам. инв. №
- MCP4921-E/SN
- Инв. № подл.
- Лист
- Изм.
- № докум.
- Подп.
- Дата
- Копировал
- Формат
- (in symbol connect6) Цепь
- (in symbol interf10) DAC
- (in symbol microcont10) MPU

### Library data of the parts
C17 C18 = cap135: Конденсатор; Part Name: Ceramic; Manufacture: Murata; Part Number: GRM188R71A225KE15D; id: cap135; TKE: X7R
C19-C28 = cap52: as C2 on sheet WireLessPhone_Amp
DD2 = microcont10: Part Name: Microcontroller; Frequency: 168MHz; ADC: 16x12b/2x12b; Interface: can, i2c, irda, lin, spi, uart, usbotg,sdio; Flash: 1Mb; Pin in: 51; Power Supply: 1.8-3.6V; id: microcont10; Part Number: STM32F405RGT6
DD3 = interf10: 12-Bit DAC with SPI™ Interface; Part Name: DAC - SPI Rail-to-Rail; Manufacture: Microchip; Resolution: 12bit; Number of Channel: 2; Vref output: yes; Type Supply: Single Polar; Power Supply: 2.7-5.5V; id: interf10; Part Number: MCP4921-E/P
L3 = ind0: EMI Suppression Filter; Part Name: EMI Suppression Filters; Part Number: BLM18PG181SN1D; Rated Current: 1,5A; id: ind0; Resistance: 0,09Ohm
R21 R22#1 R23#1 R24#1 = res290: as R12 on sheet WireLessPhone_Power; Part Name: Resistor; Power: 0,062Вт
VD4 = diode21: Диод Шоттки; Part Number: PMEG2010AEB.115; Manufacture: NXP Semiconductor; Max Reverse Voltage: 20B; Forward Voltage: 0,62B; Forward Current: 1А; Breakdown Current: 600uA; Capacitance: 25pF; Number of Channels: 1; id: diode21; Part Name: Diode Schottky
X3 = connect6: Разъем - 5 конт. вилка; Part Number: DS1021-1*5SF112-B; Manufacture: Ningbo connfly electronic; Contact_1: +3,3B; Contact_2: SWCLK; Contact_3: GND; Contact_4: SWDIO; Contact_5: RESET; Etch: 2,54mm; Part Name: PLS-5; id: connect6
Z1 = crystal5: Кварцевый резорнатор со встроенными нагрузочными конденсаторами; Manufacture: Murata; Frequence: 12MHz; id: crystal5

## Sheet WireLessPhone_PhotoHall.SchDoc
size 420 x 297 mm; DocumentNumber: ФНКЦ.542321.001 Э3; SheetNumber: 4; Format: A3
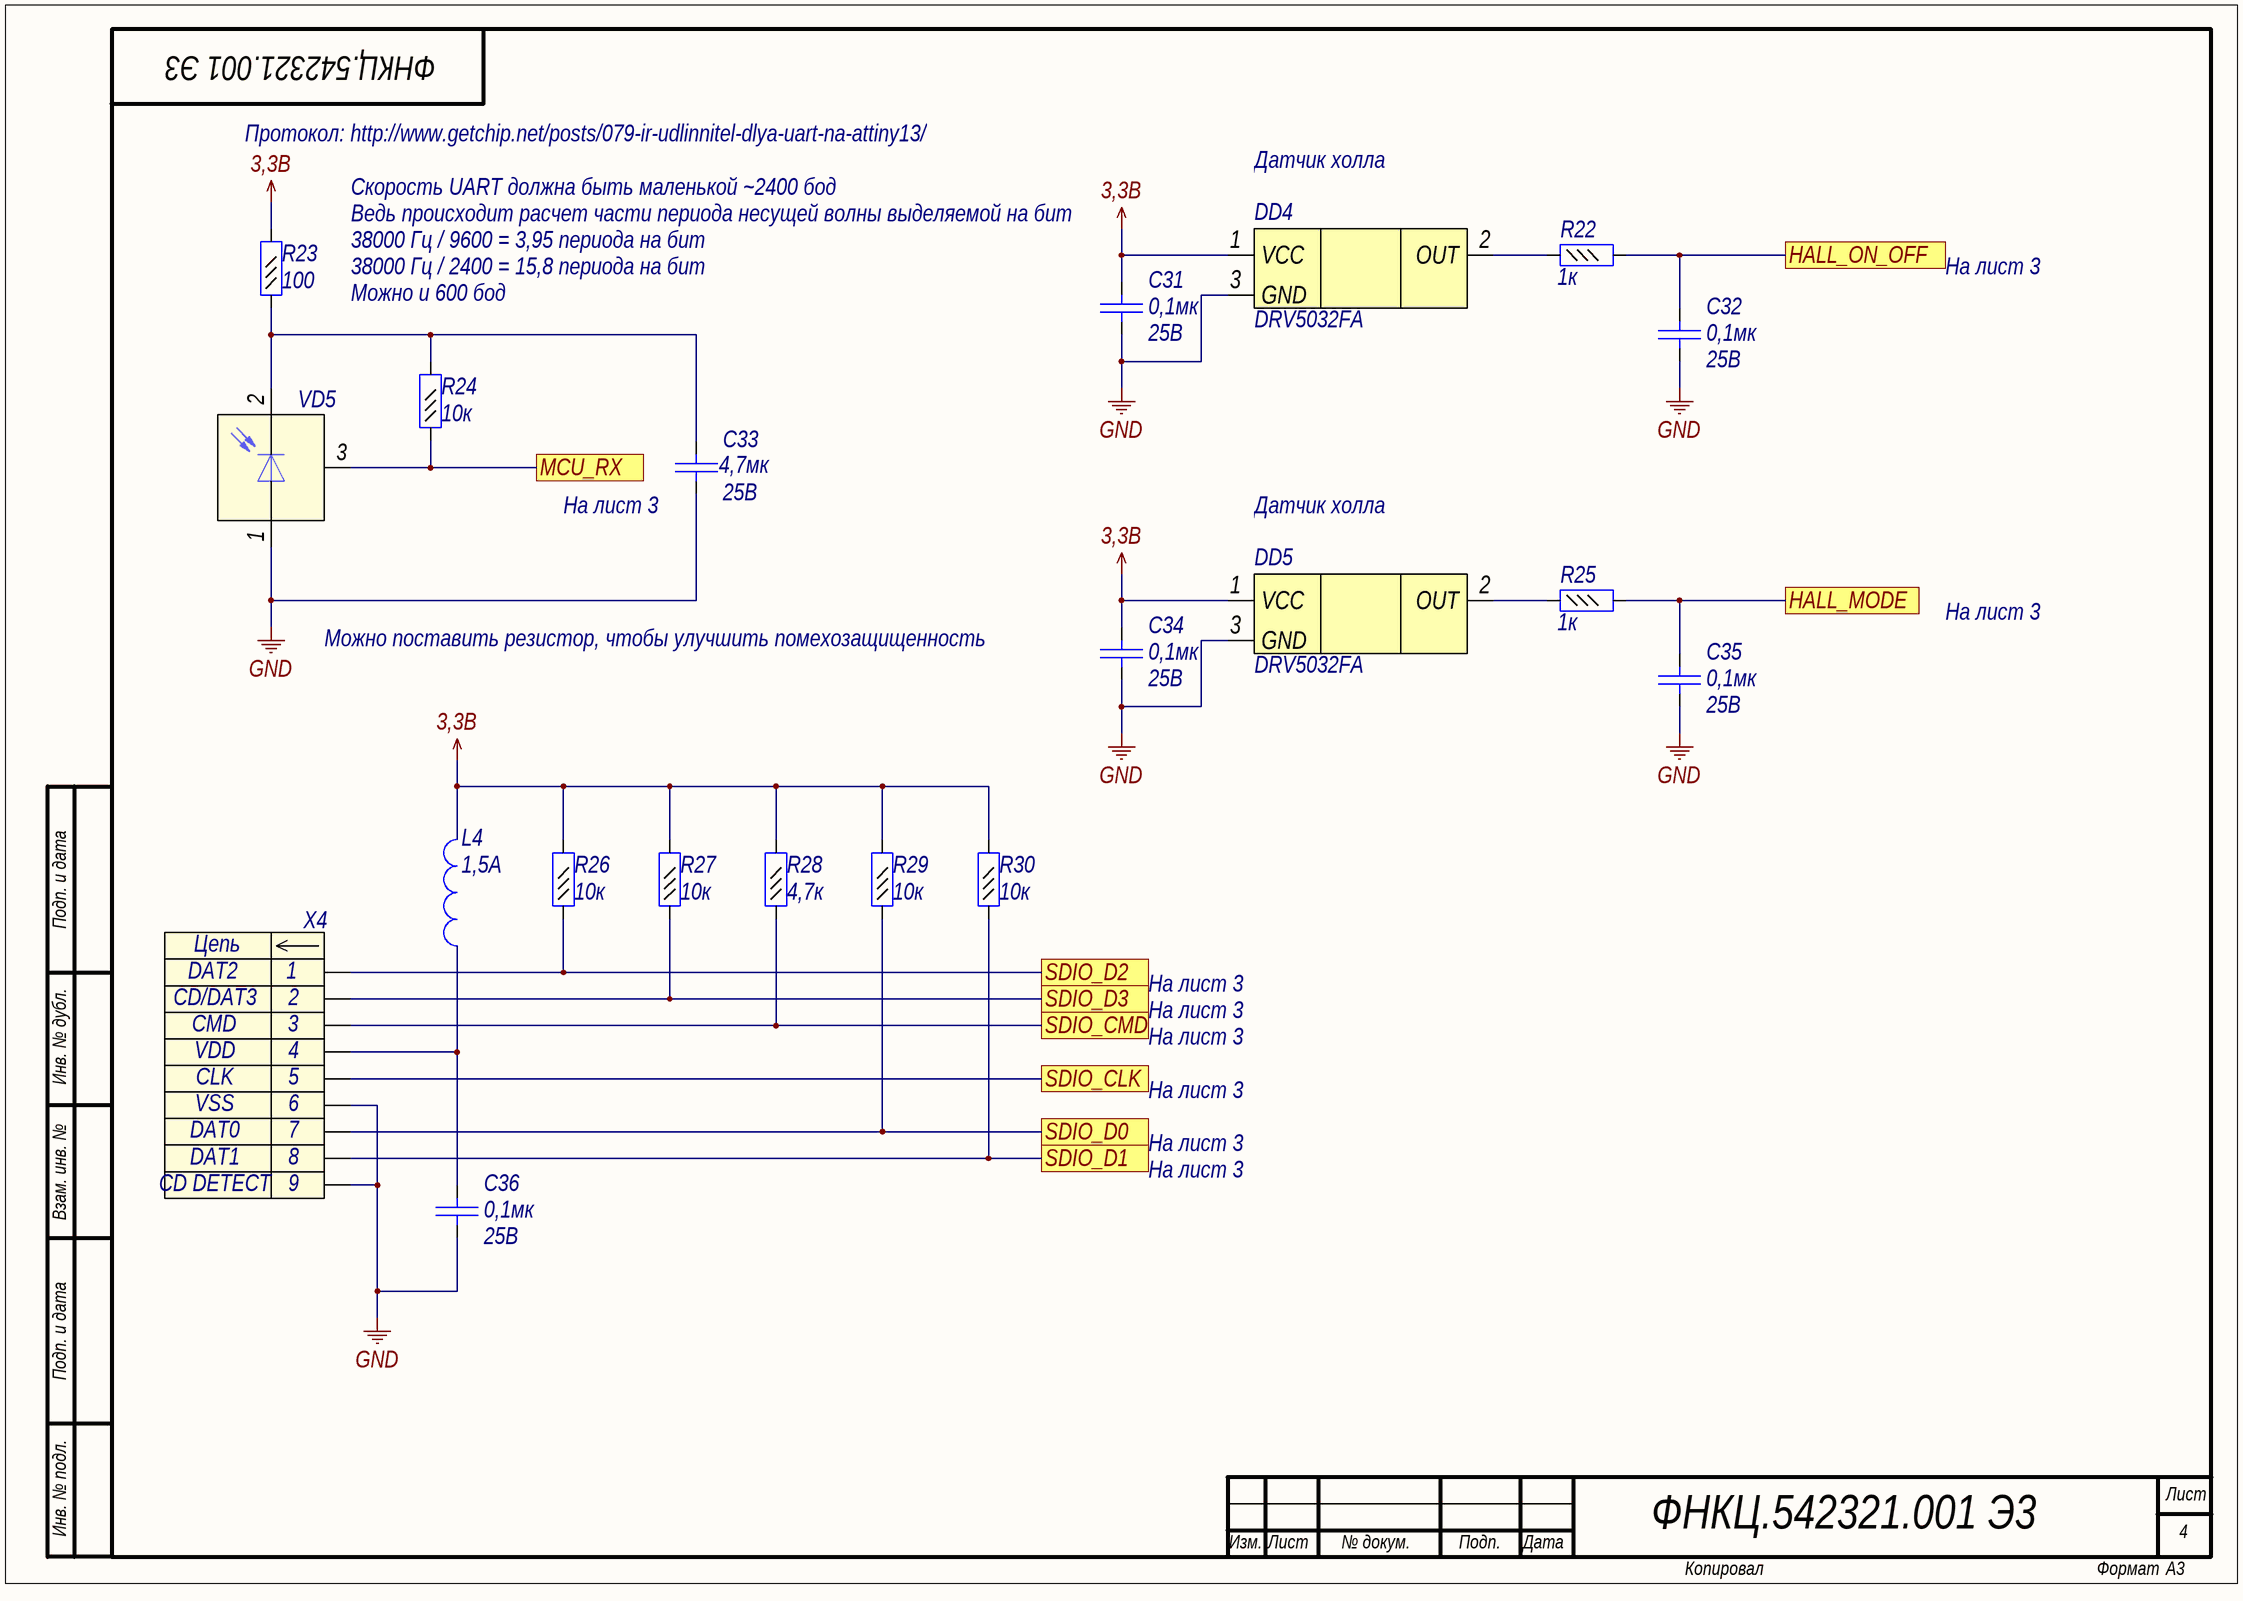
[diagram p3: WireLessPhone_PhotoHall.SchDoc]

### Parts
(Parts that share a designator on the sheet are numbered #1, #2 ... from top to bottom, then left to right.)
C31  value 0,1мк  Voltage: 25B  [C0402]  (hidden comment: Capacitor)
C32  value 0,1мк  Voltage: 25B  [C0402]  (hidden comment: Capacitor)
C33  value 4,7мк  Voltage: 25B  [C0805]  (hidden comment: Capacitor)
C34  value 0,1мк  Voltage: 25B  [C0402]  (hidden comment: Capacitor)
C35  value 0,1мк  Voltage: 25B  [C0402]  (hidden comment: Capacitor)
C36  value 0,1мк  Voltage: 25B  [C0402]  (hidden comment: Capacitor)
DD4  Part Number: DRV5032FA  [SOT23-3]  (hidden comment: DRV5032)
DD5  Part Number: DRV5032FA  [SOT23-3]  (hidden comment: DRV5032)
L4  Rated Current: 1,5A  [L0603]  (hidden comment: Inductor)
R22#2  value 1к  [R0402]  (hidden comment: Resistor_0,062Вт)
R23#2  value 100  [R0402]  (hidden comment: Resistor_0,062Вт)
R24#2  value 10к  [R0402]  (hidden comment: Resistor_0,062Вт)
R25  value 1к  [R0402]  (hidden comment: Resistor_0,062Вт)
R26  value 10к  [R0402]  (hidden comment: Resistor_0,062Вт)
R27  value 10к  [R0402]  (hidden comment: Resistor_0,062Вт)
R28  value 4,7к  [R0402]  (hidden comment: Resistor_0,062Вт)
R29  value 10к  [R0402]  (hidden comment: Resistor_0,062Вт)
R30  value 10к  [R0402]  (hidden comment: Resistor_0,062Вт)
VD5  IR_LED  [TVCAST]  (value not drawn)
X4  MICROSD-SDIO  [MICROSD]  (value not drawn)

### Ports
HALL_MODE, HALL_ON_OFF, MCU_RX, SDIO_CLK, SDIO_CMD, SDIO_D0, SDIO_D1, SDIO_D2, SDIO_D3

### Nets
3,3B: C31.1 C34.1 DD4.1(VCC) DD5.1(VCC) L4.2 R23#2.2 R26.2 R27.2 R28.2 R29.2 R30.2
GND: C31.2 C32.2 C33.1 C34.2 C35.2 C36.2 DD4.3(GND) DD5.3(GND) VD5.1(GND) X4.6 X4.9
NetC32_1: C32.1 R22#2.2 ; port HALL_ON_OFF
NetC33_2: C33.2 R23#2.1 R24#2.2 VD5.2(VCC)
NetC35_1: C35.1 R25.2 ; port HALL_MODE
NetC36_1: C36.1 L4.1 X4.4
NetDD2_17: R24#2.1 VD5.3(OUT) ; port MCU_RX
NetDD2_39: R29.1 X4.7 ; port SDIO_D0
NetDD2_40: R30.1 X4.8 ; port SDIO_D1
NetDD2_51: R26.1 X4.1 ; port SDIO_D2
NetDD2_52: R27.1 X4.2 ; port SDIO_D3
NetDD2_53: X4.5 ; port SDIO_CLK
NetDD2_54: R28.1 X4.3 ; port SDIO_CMD
NetDD4_2: DD4.2(OUT) R22#2.1
NetDD5_2: DD5.2(OUT) R25.1

### Notes on the sheet
- Протокол: http://www.getchip.net/posts/079-ir-udlinnitel-dlya-uart-na-attiny13/
- Датчик холла
- Скорость UART должна быть маленькой ~2400 бод
- Ведь происходит расчет части периода несущей волны выделяемой на бит
- 38000 Гц / 9600 = 3,95 периода на бит
- 38000 Гц / 2400 = 15,8 периода на бит
- Можно и 600 бод
- На лист 3
- (near C33) На лист 3
- Можно поставить резистор, чтобы улучшить помехозащищенность
- Подп. и дата
- Инв. № дубл.
- Взам. инв. №
- Инв. № подл.
- Лист
- Изм.
- № докум.
- Подп.
- Дата
- Копировал
- Формат
- (in symbol connect43) Цепь; CD DETECT

### Library data of the parts
C31 C32 C34-C36 = cap52: as C2 on sheet WireLessPhone_Amp
C33 = cap154: as C10 on sheet WireLessPhone_Power
DD4 DD5 = DRV5032FA: Датчик Холла с рекордно низким потреблением; Part Name: Hall sensor; Manufacture: Texas Instruments; id: hall1; Magnetic threshold: 4,8mT; MAGNETIC RESPONSE: Omnipolar; OUTPUT TYPE: Push-pull; SAMPLING RATE: 20 Hz; Power Supply: 1,65B...5,5B
L4 = ind0: EMI Suppression Filter; Part Name: EMI Suppression Filters; Part Number: BLM18PG181SN1D; id: ind0; Resistance: 0,09Ohm
R22#2 R25 = res266: as R18 on sheet WireLessPhone_Power; Part Name: Resistor; Power: 0,062Вт
R23#2 = res242: Резистор; Manufacture: Yageo; Part Number: RC0402FR-07100RL; id: res242; Accuracy: 1%; Part Name: Resistor; Power: 0,062Вт
R24#2 R26 R27 R29 R30 = res290: as R12 on sheet WireLessPhone_Power; Part Name: Resistor; Power: 0,062Вт
R28 = res282: Резистор; Manufacture: Yageo; Part Number: RC0402FR-074K7; id: res282; Accuracy: 1%; Part Name: Resistor; Power: 0,062Вт
VD5 = diode26: Светодиод; Part Name: IR Receiver Modules; Part Number: TSOP39238; Manufacture: Vishay; Supply Voltage: 2,5-5,5B; Carrier Frequency: 38kHz; Transmission Distance: 30m; Viewing Angle: (+-)45; Detection Treshold: 0.08; id: diode26
X4 = connect43: Contact_1: DAT2; Contact_2: CD/DAT3; Contact_3: CMD; Contact_4: VDD; Contact_5: CLK; Contact_6: VSS; Contact_7: DAT0; Contact_8: DAT1; Part Name: MICRO SD-SDIO; id: connect43

## Nets that join several sheets
3,3B: WireLessPhone_Power (C14.2 DA3.4 L2.2), WireLessPhone_Microcontroller (18 pins), WireLessPhone_PhotoHall (11 pins)
3,8B: WireLessPhone_Amp (7 pins), WireLessPhone_Power (12 pins), WireLessPhone_Microcontroller (DD2.42)
AGND: WireLessPhone_Amp (8 pins), WireLessPhone_Power (DA2.1 DA2.2)
GND: WireLessPhone_Amp (8 pins), WireLessPhone_Power (17 pins), WireLessPhone_Microcontroller (20 pins), WireLessPhone_PhotoHall (11 pins)
D_N: WireLessPhone_Power (VD3.4), WireLessPhone_Microcontroller (DD2.44)
D_P: WireLessPhone_Power (VD3.6), WireLessPhone_Microcontroller (DD2.45)
NetC15_1: WireLessPhone_Power (C15.1 R19.1), WireLessPhone_Microcontroller (DD2.27)
NetC32_1: WireLessPhone_Microcontroller (DD2.15), WireLessPhone_PhotoHall (C32.1 R22#2.2)
NetC35_1: WireLessPhone_Microcontroller (DD2.10), WireLessPhone_PhotoHall (C35.1 R25.2)
NetDD1_1: WireLessPhone_Amp (DD1.1), WireLessPhone_Power (X2.1 X2.2)
NetDD1_3: WireLessPhone_Amp (DD1.3), WireLessPhone_Microcontroller (DD2.9)
NetDD1_7: WireLessPhone_Amp (DD1.7), WireLessPhone_Microcontroller (DD2.8)
NetDD2_17: WireLessPhone_Microcontroller (DD2.17), WireLessPhone_PhotoHall (R24#2.1 VD5.3)
NetDD2_39: WireLessPhone_Microcontroller (DD2.39), WireLessPhone_PhotoHall (R29.1 X4.7)
NetDD2_40: WireLessPhone_Microcontroller (DD2.40), WireLessPhone_PhotoHall (R30.1 X4.8)
NetDD2_43: WireLessPhone_Power (R11.1 X1.4), WireLessPhone_Microcontroller (DD2.43)
NetDD2_51: WireLessPhone_Microcontroller (DD2.51), WireLessPhone_PhotoHall (R26.1 X4.1)
NetDD2_52: WireLessPhone_Microcontroller (DD2.52), WireLessPhone_PhotoHall (R27.1 X4.2)
NetDD2_53: WireLessPhone_Microcontroller (DD2.53), WireLessPhone_PhotoHall (X4.5)
NetDD2_54: WireLessPhone_Microcontroller (DD2.54), WireLessPhone_PhotoHall (R28.1 X4.3)
NetDD3_8: WireLessPhone_Amp (R2.2), WireLessPhone_Microcontroller (DD3.8)